# Altium project schb.PrjPCB
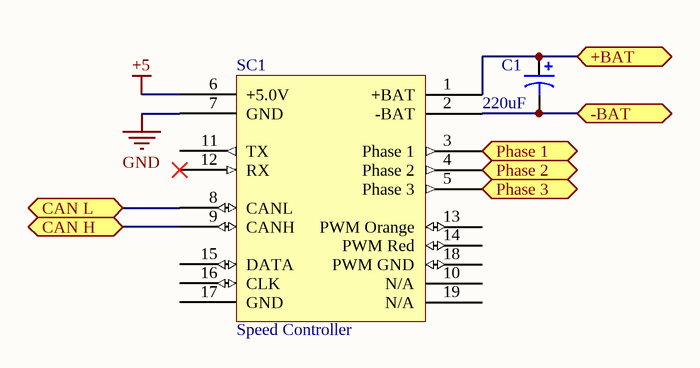
[diagram p0: Speed Controller.SchDoc]
1 sheet, 2 parts. Net scope: flat (ports and power ports of the same name join across sheets).
Board file: schb.PcbDoc

## Sheet Speed Controller.SchDoc
size A4

### Parts
C1  value 220uF  [220uf radial Capacitor]  (hidden comment: Cap Pol1)
SC1  Speed Controller  [Autoquad-esc32-speed-controller]

### Ports
+BAT, -BAT, CAN H, CAN L, Phase 1 (out), Phase 2 (out), Phase 3 (out)

### Nets
+5: SC1.6(+5.0V)
GND: SC1.7(GND)
NetC1_1: C1.1 SC1.1(+BAT) ; port +BAT
NetC1_2: C1.2 SC1.2(-BAT) ; port -BAT
NetSC1_3: SC1.3(Phase_1) ; port Phase 1
NetSC1_4: SC1.4(Phase_2) ; port Phase 2
NetSC1_5: SC1.5(Phase_3) ; port Phase 3
NetSC1_8: SC1.8(CANL) ; port CAN L
NetSC1_9: SC1.9(CANH) ; port CAN H

Not connected (* = marked no-connect by the designer): SC1 10(N/A) 11(TX) 12(RX)* 13(PWM_Orange) 14(PWM_Red) 15(DATA) 16(CLK) 17(GND) 18(PWM_GND) 19(N/A)

### Library data of the parts
C1 = Cap Pol1: Polarized Capacitor (Radial); Published: 8-Jun-2000; LatestRevisionDate: 17-Jul-2002; LatestRevisionNote: Re-released for DXP Platform.; PackageReference: RB7.6-15; Publisher: Altium Limited; farnell: 8126569
SC1 = Speed Controller: Autoquad ESC32 Speed Controller